# Altium schematic sheet sensors.SchDoc: myA4
size A4; Date: 2018/03/30; DrawnBy: 亓岳鑫; Organization: Altium Limited; Address1: 3 Minna Close; Address2: Belrose; Address3: NSW 2085; Address4: Australia; DocumentNumber: 3; Revision: Alfa 2.0; SheetNumber: 3; SheetTotal: 6; Time: 17:30
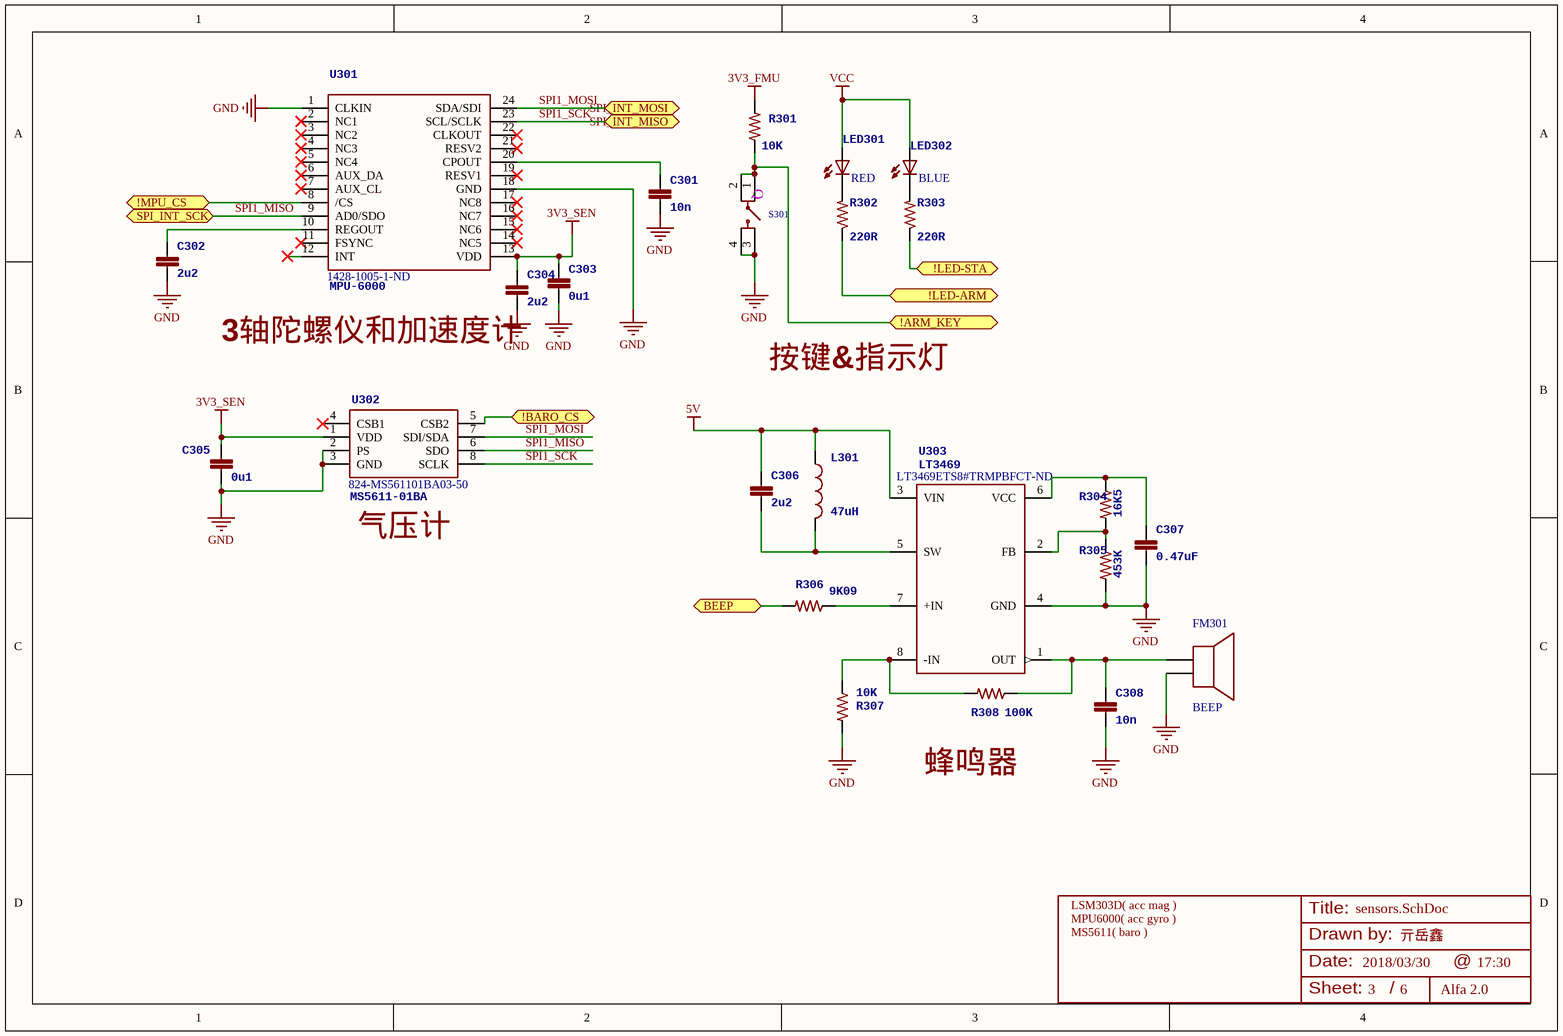
[diagram p0: sensors.SchDoc]

## Parts
C301  10n  [0603-CAP]
C302  2u2  [0603-CAP]
C303  0u1  [0603-CAP]
C304  2u2  [0603-CAP]
C305  0u1  [0603-CAP]
C306  2u2  [0603-CAP]
C307  0.47uF  [0603-CAP]
C308  10n  [0603-CAP]
FM301  BEEP  [BEEP-12mm]
L301  47uH  [1210 - IND]
LED301  Color: RED  [0603-LED]  (hidden comment: APT1608SECK)
LED302  Color: BLUE  [0603-LED]  (hidden comment: APT1608QBC/G)
R301  10K  [0603-RES]
R302  220R  [0603-RES]
R303  220R  [0603-RES]
R304  16K5  [0603-RES]
R305  453K  [0603-RES]
R306  9K09  [0603-RES]
R307  10K  [0603-RES]
R308  100K  [0603-RES]
S301  SWITCH  [SW_6*6]  (value not drawn)
U301  MPU-6000  Supplier Part Number 1: 1428-1005-1-ND  [QFN-24]
U302  MS5611-01BA  Supplier Part Number 1: 824-MS561101BA03-50  [MS5611-01BA]
U303  LT3469  Supplier Part Number 1: LT3469ETS8#TRMPBFCT-ND  [SOT23-8]

## Ports
!ARM_KEY, !BARO_CS, !LED-ARM, !LED-STA, !MPU_CS, BEEP, SPI_INT_MISO, SPI_INT_MOSI, SPI_INT_SCK

## Nets
3V3_FMU: R301.2
3V3_SEN: C303.P$1 C304.P$1 C305.P$1 U301.13(VDD) U302.1(VDD)
5V: C306.P$1 L301.1 U303.3(VIN)
GND: C301.P$2 C302.P$2 C303.P$2 C304.P$2 C305.P$2 C307.P$2 C308.P$2 FM301.2 R305.2 R307.2 S301.3 S301.4 U301.1(CLKIN) U301.18(GND) U302.2(PS) U302.3(GND) U303.4(GND)
VCC: LED301.A LED302.A
!ARM_KEY: R301.1 S301.1 S301.2 ; port !ARM_KEY
!BARO_CS: U302.5(CSB2) ; port !BARO_CS
!LED-ARM: R302.1 ; port !LED-ARM
!LED-STA: R303.1 ; port !LED-STA
!MPU_CS: U301.8(/CS) ; port !MPU_CS
BEEP: R306.2 ; port BEEP
SPI1_MISO: U301.9(AD0/SDO) U302.6(SDO) ; port SPI_INT_SCK
SPI1_MOSI: U301.24(SDA/SDI) U302.7(SDI/SDA) ; port SPI_INT_MOSI
SPI1_SCK: U301.23(SCL/SCLK) U302.8(SCLK) ; port SPI_INT_MISO
NetC301_P$1: C301.P$1 U301.20(CPOUT)
NetC302_P$1: C302.P$1 U301.10(REGOUT)
NetC306_P$2: C306.P$2 L301.2 U303.5(SW)
NetC307_P$1: C307.P$1 R304.1 U303.6(VCC)
NetC308_P$1: C308.P$1 FM301.1 R308.1 U303.1(OUT)
NetLED301_C: LED301.C R302.2
NetLED302_C: LED302.C R303.2
NetR304_2: R304.2 R305.1 U303.2(FB)
NetR306_1: R306.1 U303.7(+IN)
NetR307_1: R307.1 R308.2 U303.8(-IN)

Not connected (* = marked no-connect by the designer): U301 2(NC1)* 3(NC2)* 4(NC3)* 5(NC4)* 6(AUX_DA)* 7(AUX_CL)* 11(FSYNC)* 12(INT) 14(NC5)* 15(NC6)* 16(NC7)* 17(NC8)* 19(RESV1)* 21(RESV2)* 22(CLKOUT)*; U302 4(CSB1)*

## Notes on the sheet
- 3轴陀螺仪和加速度计
- 按键&指示灯
- (near U302) 气压计
- (near R308) 蜂鸣器
- LSM303D( acc mag )
- MPU6000( acc gyro )
- MS5611( baro )
- Title:
- Drawn by:
- Date:
- @
- Sheet:
- /
- (in symbol SWITCH) Q

## Library data of the parts
C301 C308 = CAP0603-10nF: Capacitor, 10nF, 50V; PARTNO: CC0402ZRY5V7BB104; 3DR_PARTNO: ECM0700; Value: 10n
C302 C304 C306 = CAP0603-2.2uF: Capacitor, 2.2uF, 16V, 10%, X6S, 0603, Ceramic; PARTNO: C1608X6S1C225K080AC; 3DR_PARTNO: ECM0619; Supplier 1: Digi-Key; Value: 2u2; Supplier Part Number 1: 445-7438-1-ND
C303 C305 = CAP0603-0.1uF: Capacitor, 0.1uF, 16V, Y5V, 0402, Ceramic; PARTNO: CC0402ZRY5V7BB104; 3DR_PARTNO: ECM0700; Value: 0u1; Supplier 1: Digi-Key; Supplier Part Number 1: 311-1776-1-ND
C307 = CAP0603-0.47uF: Capacitor, 0.47uF, 16V, 10%, X6S, 0603, Ceramic; 3DR_PARTNO: ECM0619; Value: 0.47uF
FM301 = BEEP: 蜂鸣器; 驱动芯片: LT3469
L301 = INDUCTOR-1210: 贴片功率电感，绕线工字电感; PARTNO: LQH32CN470, 1.3Ω; 3DR_PARTNO: ECM0814; Value: 47UH; PARTNO2: LBC2518T470M,  1.9Ω; Supplier 1: Digi-Key; Supplier 2: Digi-Key; Supplier Part Number 1: 490-2497-1-ND; Supplier Part Number 2: 587-5881-1-ND
LED301 = LED0603-RED: 2.2v, LED RED CLEAR 0603 SMD; 3DR_PARTNO: ECM0515; PARTNO: APT1608SECK; Supplier 1: Digi-Key; Supplier Part Number 1: 754-1786-1-ND
LED302 = LED0603-BLUE: 3.3v, LED BLUE CLEAR 0603 SMD; 3DR_PARTNO: ECM0515; PARTNO: APT1608QBC/G; Supplier 1: Digi-Key; Supplier Part Number 1: 754-1501-2-ND
R301 R307 = RES0603-10K: RES 10K OHM 1/10W 5% 0603; Value: 10K; Supplier 1: Digi-Key; Supplier Part Number 1: A126331TR-ND
R302 R303 = RES0603-220R: RES 220R OHM 1/10W 5% 0603; Value: 220R; Supplier 1: Digi-Key; Supplier Part Number 1: 311-220GRCT-ND
R304 = RES0603-16K5: RES 16K5 OHM 1/10W 5% 0603; Value: 16K5; Supplier 1: Digi-Key; Supplier Part Number 1: 311-16.5KHRCT-ND
R305 = RES0603-453K: RES 453K OHM 1/10W 5% 0603; Value: 453K; Supplier 1: Digi-Key; Supplier Part Number 1: 311-453KHRCT-ND
R306 = RES0603-9K09: RES 9K09 OHM 1/10W 5% 0603; Value: 9K09; Supplier 1: Digi-Key; Supplier Part Number 1: 311-9.09KDCT-ND
R308 = RES0603-100K: RES 100K OHM 1/10W 5% 0603; Value: 100K; Supplier 1: Digi-Key; Supplier Part Number 1: 311-100KGRCT-ND
S301 = SWITCH: 6*6*4.3 微动轻触开关贴片
U301 = MPU-6000: GYRO/ACCELEROMETER 6AXIS 24QFN; 3DR_PARTNO: ECM0834; DATASHEET: http://invensense.com/mems/gyro/documents/PS-MPU-6000A-00_v1.0.pdf; LINK: http://invensense.com/mems/gyro/mpu6000.html; MFGPN: MPU-6000; Supplier 1: Digi-Key; PARTNO: MPU-6000
U302 = MS5611-01BA: Board Mount Pressure Sensors; 3DR_PARTNO: ECM0835; Value: 10-1200mbar; DATASHEET: http://www.meas-spec.com/downloads/MS5611-01BA01.pdf; LINK: http://www.meas-spec.com/product/t_product.aspx?id=8503#; MFGPN: MS5611-01BA; PARTNO: MS5611-01BA; Supplier 1: Mouser
U303 = LT3469: IC AMP DVR W/REG 1.3MHZ TSOT23-8; 3DR_PARTNO: ECM0829; Value: BUZZER; Supplier 1: Digi-Key